# Altium schematic sheet Connector-Side-2.SchDoc: =ProjectTitle
size 297 x 209 mm; Address1: Address1; Address2: Address2; Address3: Address3; Address4: Address4; SheetNumber: 13; SheetTotal: 16; Scale: 1:1; DocumentType: Схема электрическая принципиальная
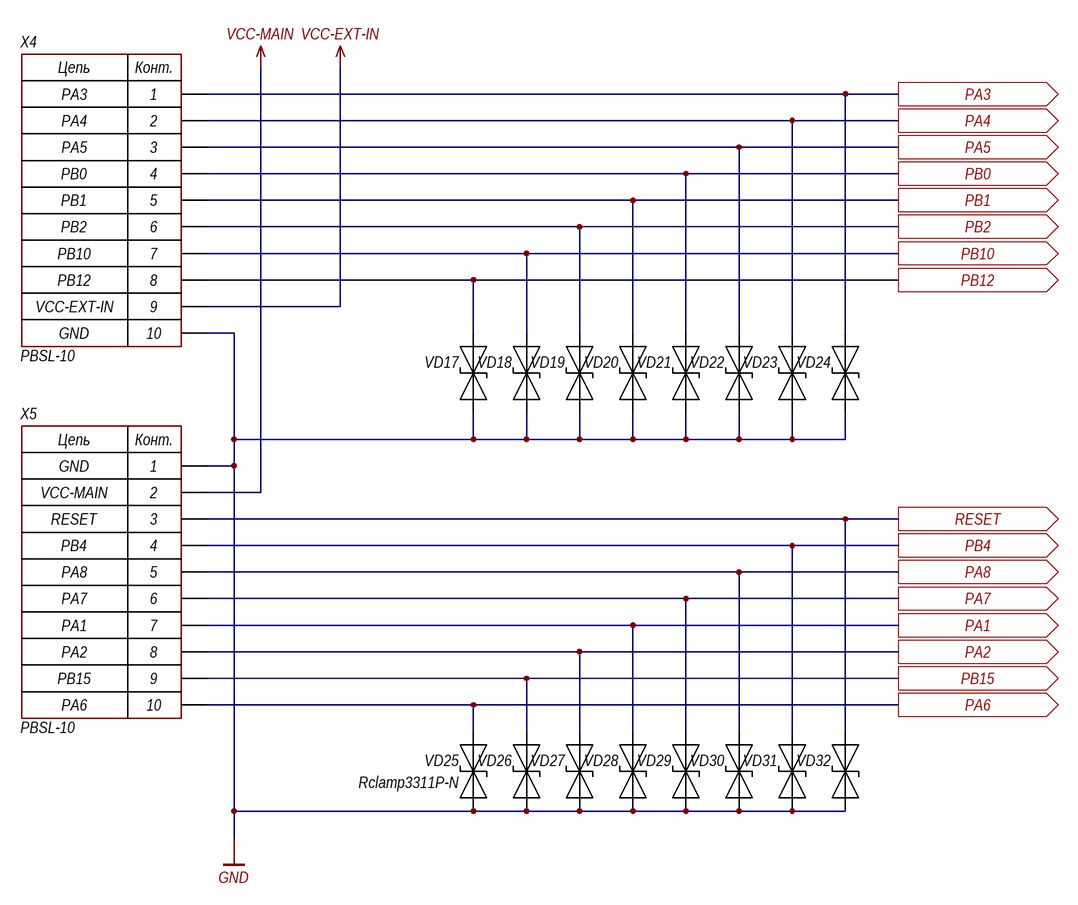
[diagram p0: Connector-Side-2.SchDoc]

## Parts
VD17  Rclamp3311P-N  [DFN1006-2]  (value not drawn)
VD18  Rclamp3311P-N  [DFN1006-2]  (value not drawn)
VD19  Rclamp3311P-N  [DFN1006-2]  (value not drawn)
VD20  Rclamp3311P-N  [DFN1006-2]  (value not drawn)
VD21  Rclamp3311P-N  [DFN1006-2]  (value not drawn)
VD22  Rclamp3311P-N  [DFN1006-2]  (value not drawn)
VD23  Rclamp3311P-N  [DFN1006-2]  (value not drawn)
VD24  Rclamp3311P-N  [DFN1006-2]  (value not drawn)
VD25  Rclamp3311P-N  [DFN1006-2]
VD26  Rclamp3311P-N  [DFN1006-2]  (value not drawn)
VD27  Rclamp3311P-N  [DFN1006-2]  (value not drawn)
VD28  Rclamp3311P-N  [DFN1006-2]  (value not drawn)
VD29  Rclamp3311P-N  [DFN1006-2]  (value not drawn)
VD30  Rclamp3311P-N  [DFN1006-2]  (value not drawn)
VD31  Rclamp3311P-N  [DFN1006-2]  (value not drawn)
VD32  Rclamp3311P-N  [DFN1006-2]  (value not drawn)
X4  PBSL-10  [CON: PBSL-10]
X5  PBSL-10  [CON: PBSL-10]

## Ports
PA1 (out), PA2 (out), PA3 (out), PA4 (out), PA5 (out), PA6 (out), PA7 (out), PA8 (out), PB0 (out), PB1 (out), PB2 (out), PB4 (out), PB10 (out), PB12 (out), PB15 (out), RESET (out)

## Nets
GND: VD17.1(A) VD18.1(A) VD19.1(A) VD20.1(A) VD21.1(A) VD22.1(A) VD23.1(A) VD24.1(A) VD25.1(A) VD26.1(A) VD27.1(A) VD28.1(A) VD29.1(A) VD30.1(A) VD31.1(A) VD32.1(A) X4.10 X5.1
VCC-EXT-IN: X4.9
VCC-MAIN: X5.2
PA1: VD28.2(C) X5.7 ; port PA1
PA2: VD27.2(C) X5.8 ; port PA2
PA3: VD24.2(C) X4.1 ; port PA3
PA4: VD23.2(C) X4.2 ; port PA4
PA5: VD22.2(C) X4.3 ; port PA5
PA6: VD25.2(C) X5.10 ; port PA6
PA7: VD29.2(C) X5.6 ; port PA7
PA8: VD30.2(C) X5.5 ; port PA8
PB0: VD21.2(C) X4.4 ; port PB0
PB1: VD20.2(C) X4.5 ; port PB1
PB2: VD19.2(C) X4.6 ; port PB2
PB4: VD31.2(C) X5.4 ; port PB4
PB10: VD18.2(C) X4.7 ; port PB10
PB12: VD17.2(C) X4.8 ; port PB12
PB15: VD26.2(C) X5.9 ; port PB15
RESET: VD32.2(C) X5.3 ; port RESET

## Notes on the sheet
- PA3
- PA4
- PB0
- PA5
- PB1
- PB2
- PB10
- PB12
- VCC-EXT-IN
- GND
- VCC-MAIN
- RESET
- PA7
- PA8
- PB4
- PA1
- PA2
- PA6
- PB15
- Изм.
- Лист
- № докум.
- Подп.
- Дата
- Копировал
- Формат А4
- (in symbol 10-Connector) Цепь; Конт.

## Library data of the parts
VD17-VD32 = TVS-diod: Manufacturer: BORN; ComponentKind: 3.3V, 8V. 10A; Model: Rclamp3311P-N; HelpURL: https://www.lcsc.com/product-detail/ESD-Protection-Devices_BORN-Rclamp3311P-N_C406234.html
X4 X5 = 10-Connector: Model: PBSL-10; Manufacturer: *; HelpURL: *; ComponentKind: *